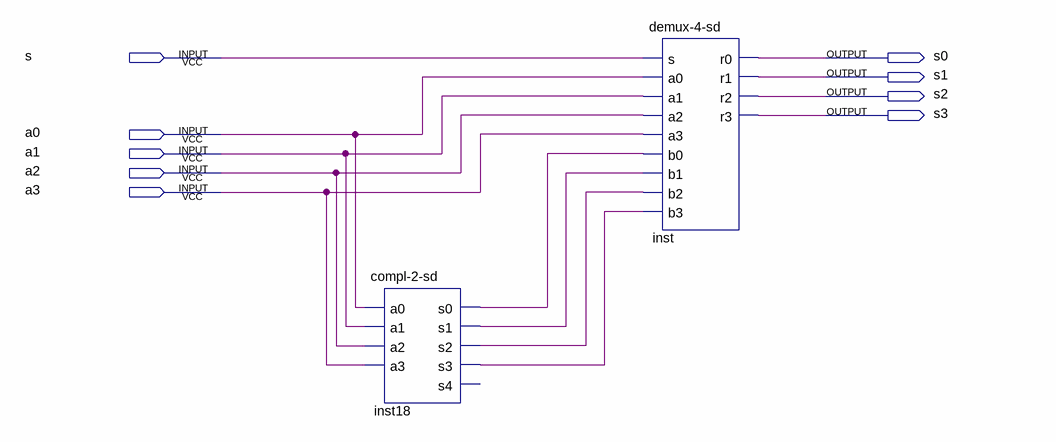
[diagram p0: schematic sheet]
// Quartus schematic cmpl-2-or-not.bdf as structural Verilog: 2 symbols, 9 pins
module \cmpl-2-or-not  (
  input  s,
  input  a0,
  input  a1,
  input  a2,
  input  a3,
  output s0,
  output s1,
  output s2,
  output s3
);

  wire inst18_s0, inst18_s1, inst18_s2, inst18_s3;

  \compl-2-sd  inst18 (
    .a0(a0), .a1(a1), .a2(a2), .a3(a3), .s0(inst18_s0), .s1(inst18_s1), .s2(inst18_s2), .s3(inst18_s3));  // open: s4
  \demux-4-sd  inst (
    .s(s), .a0(a0), .a1(a1), .a2(a2), .a3(a3), .b0(inst18_s0), .b1(inst18_s1), .b2(inst18_s2),
    .b3(inst18_s3), .r0(s0), .r1(s1), .r2(s2), .r3(s3));
endmodule
